# Altium project 48V-5V Buck.PrjPcb
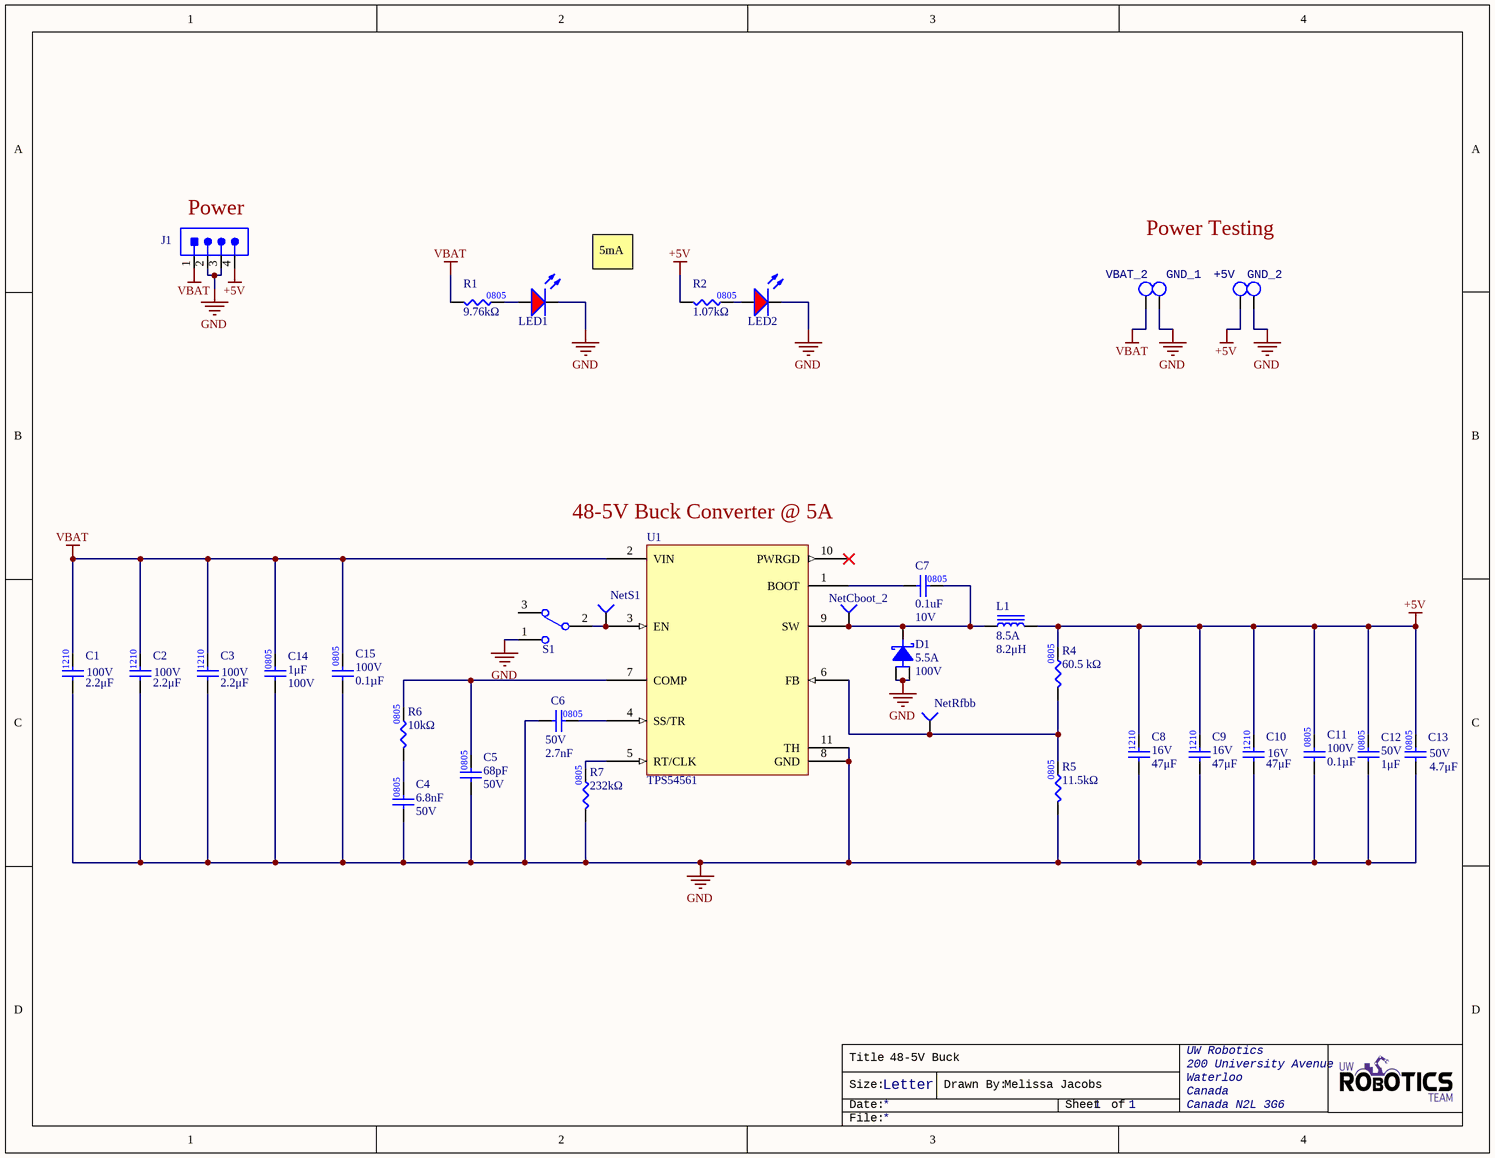
[diagram p0: 48V-5V Buck.SchDoc]
1 sheet, 35 parts. Net scope: global (net labels, ports and power ports of the same name join across sheets).
Board files: 48V-5V Buck.PcbDoc, 48V-5V Buck.~(1).PcbDoc

## Sheet 48V-5V Buck.SchDoc: 48-5V Buck
size Letter; DrawnBy: Melissa Jacobs; Organization: UW Robotics; Address1: 200 University Avenue; Address2: Waterloo; Address3: Canada; Address4: Canada N2L 3G6; Revision: 1; SheetNumber: 1; SheetTotal: 1

### Parts
+5V  TESTPOINT_LOOP  [TESTPOINT_LOOP]  (value not drawn)
C1  value 2.2μF  Voltage Rating: 100V  [CAPC3225X270N]  (hidden comment: CAP_2.2uF_100V_1210_1)
C2  value 2.2μF  Voltage Rating: 100V  [CAPC3225X270N]  (hidden comment: CAP_2.2uF_100V_1210_1)
C3  value 2.2μF  Voltage Rating: 100V  [CAPC3225X270N]  (hidden comment: CAP_2.2uF_100V_1210_1)
C4  value 6.8nF  Voltage Rating: 50V  [CAP0805]  (hidden comment: CAP_6.8nF_100V_0805)
C5  value 68pF  Voltage Rating: 50V  [CAP0805]  (hidden comment: CAP_68pF_50V_0805)
C6  value 2.7nF  Voltage Rating: 50V  [CAP0805]  (hidden comment: CAP_2.7nF_50V_0805)
C7  value 0.1uF  Voltage Rating: 10V  [CAP0805]  (hidden comment: CAP_0.1uF_10V_0805)
C8  value 47μF  Voltage Rating: 16V  [CAPC3225X270N]  (hidden comment: CAP_47uF_16V_1210)
C9  value 47μF  Voltage Rating: 16V  [CAPC3225X270N]  (hidden comment: CAP_47uF_16V_1210)
C10  value 47μF  Voltage Rating: 16V  [CAPC3225X270N]  (hidden comment: CAP_47uF_16V_1210)
C11  value 0.1µF  Voltage Rating: 100V  [CAP0805]  (hidden comment: CAP_0.1uF_100V_0805)
C12  value 1μF  Voltage Rating: 50V  [CAP0805]  (hidden comment: CAP_1uF_50V_0805)
C13  value 4.7μF  Voltage Rating: 50V  [CAP0805]  (hidden comment: CAP_4.7uF_50V_0805)
C14  value 1μF  Voltage Rating: 100V  [CAP0805]  (hidden comment: CAP_1uF_100V_0805)
C15  value 0.1µF  Voltage Rating: 100V  [CAP0805]  (hidden comment: CAP_0.1uF_100V_0805)
D1  5.5A  Vr (Max): 100V  [D-PAK]
GND_1  TESTPOINT_LOOP  [TESTPOINT_LOOP]  (value not drawn)
GND_2  TESTPOINT_LOOP  [TESTPOINT_LOOP]  (value not drawn)
J1  CON_2POS_SCREW_TERM  [MPT-04-01-01-L-RA-SD]  (value not drawn)
L1  value 8.2μH  Current Rating: 8.5A  [IND_8.2uH_8.5A]  (hidden comment: IND_8.2uH_8.5A)
LED1  LED_RED  [LED_0805_RED]  (value not drawn)
LED2  LED_RED  [LED_0805_RED]  (value not drawn)
NetCboot_2  TESTPOINT_1MM_CIRCLE  [TESTPOINT_CIRCLE_1MM]  (value not drawn)  (no BOM)
NetRfbb  TESTPOINT_1MM_CIRCLE  [TESTPOINT_CIRCLE_1MM]  (value not drawn)  (no BOM)
NetS1  TESTPOINT_1MM_CIRCLE  [TESTPOINT_CIRCLE_1MM]  (value not drawn)  (no BOM)
R1  value 9.76kΩ  [RES0805]  (hidden comment: RES_9.76kΩ_0805_1%)
R2  value 1.07kΩ  [RES0805]  (hidden comment: RES_1kΩ_0805_1%)
R4  value 60.5 kΩ  [RES0805]  (hidden comment: RES_60.4kΩ_0805_1%)
R5  value 11.5kΩ  [RES0805]  (hidden comment: RES_11.5kΩ_0805_0.1%)
R6  value 10kΩ  [RES0805]  (hidden comment: RES_10kΩ_0805_5%)
R7  value 232kΩ  [RES0805]  (hidden comment: RES_232kΩ_0805_1%)
S1  SW_SLIDE_TOGGLE  [SW_SLIDE_TOGGLE]  (value not drawn)
U1  TPS54561  [BUCK_TPS54561DPRR]
VBAT_2  TESTPOINT_LOOP  [TESTPOINT_LOOP]  (value not drawn)

### Nets
+5V: +5V.1 C8.2 C9.2 C10.2 C11.2 C12.2 C13.2 J1.4 L1.2 R2.1 R4.2
GND: C1.1 C2.1 C3.1 C4.1 C5.1 C6.1 C8.1 C9.1 C10.1 C11.1 C12.1 C13.1 C14.1 C15.1 D1.1(Anode) D1.3 GND_1.1 GND_2.1 J1.2 J1.3 LED1.2(K) LED2.2(K) R5.1 R7.1 S1.1 U1.8(GND) U1.11(TH)
VBAT: C1.2 C2.2 C3.2 C14.2 C15.2 J1.1 R1.1 U1.2(VIN) VBAT_2.1
NetC4_2: C4.2 R6.1
NetC5_2: C5.2 R6.2 U1.7(COMP)
NetC6_2: C6.2 U1.4(SS/TR)
NetC7_1: C7.1 U1.1(BOOT)
NetC7_2: C7.2 D1.2(Cathode) L1.1 NetCboot_2.1(=value) U1.9(SW)
NetLED1_1: LED1.1(A) R1.2
NetLED2_1: LED2.1(A) R2.2
NetNetRfbb_1: NetRfbb.1(=value) R4.1 R5.2 U1.6(FB)
NetNetS1_1: NetS1.1(=value) S1.2 U1.3(EN)
NetR7_2: R7.2 U1.5(RT/CLK)

Not connected (* = marked no-connect by the designer): S1 3; U1 10(PWRGD)*

### Notes on the sheet
- (near J1) Power
- Power Testing
- 5mA
- (near U1) 48-5V Buck Converter @ 5A
- Title
- Size:
- Date:
- Letter
- Drawn By:
- Sheet
- of
- File:

### Library data of the parts
+5V GND_1 GND_2 VBAT_2 = TESTPOINT_LOOP: TESTPOINT THRUHOLE; Manufacturer 1: Keystone Electronics; Manufacturer Part Number 1: 5002; Package/Footprint: TH; Supplier Part Number 1: 36-5002-ND; Supplier 1: Digi-Key; Mounting Type: TH
C1-C3 = CAP_2.2uF_100V_1210_1: CAP CER 2.2UF 100V X7R 1210; Manufacturer 1: TDK Corporation; Manufacturer Part Number 1: C3225X7R2A225K230AB; Package/Footprint: 1210; Supplier 1: Digi-Key; Supplier Part Number 1: 445-4497-1-ND; Mounting Type: SMD
C4 = CAP_6.8nF_100V_0805: CAP CER 6800PF 50V C0G/NP0 0805; Manufacturer 1: Murata Electronics; Manufacturer Part Number 1: GRM2195C1H682JA01D; Package/Footprint: 0805; Supplier 1: Digi-Key; Supplier Part Number 1: 490-1638-6-ND
C5 = CAP_68pF_50V_0805: CAP CER 68PF 50V C0G/NP0 0805; Manufacturer 1: Kyocera AVX; Manufacturer Part Number 1: KGM21BCG1H680JT; Package/Footprint: 0805; Supplier 1: Digi-Key; Supplier Part Number 1: 478-KGM21BCG1H680JTDKR-ND
C6 = CAP_2.7nF_50V_0805: CAP CER 2700PF 50V C0G 0805; Manufacturer 1: TDK Corporation; Manufacturer Part Number 1: C2012C0G1H272J060AA; Package/Footprint: 0805; Supplier 1: Digi-Key; Supplier Part Number 1: 445-7508-1-ND
C7 = CAP_0.1uF_10V_0805: CAP CER 0.1uF 10V 0805; Manufacturer 1: KEMET; Manufacturer Part Number 1: C0805C104K8RAC7800; Package/Footprint: 0805; Supplier 1: Digi-Key; Supplier Part Number 1: 399-C0805C104K8RAC7800DKR-ND
C8-C10 = CAP_47uF_16V_1210: CAP CER 47uF 16V X5R 1210; Manufacturer 1: Murata Electronics; Manufacturer Part Number 1: GRM32ER61C476KE15L; Package/Footprint: 1210; Supplier 1: Digi-Key; Supplier Part Number 1: 490-6539-6-ND; Mounting Type: SMD
C11 C15 = CAP_0.1uF_100V_0805: CAP CER 0.1UF 100V X7R 0805; Manufacturer 1: TDK Corporation; Manufacturer Part Number 1: C2012X7R2A104K125AA; Package: 0805; Supplier 1: Digi-Key; Supplier Part Number 1: 445-1418-1-ND
C12 = CAP_1uF_50V_0805: CAP CER 1UF 50V X7R 0805; Manufacturer Part Number 1: CL21B105KBFNNNG; Manufacturer 1: Samsung Electro-Mechanics; Supplier Part Number 1: 1276-6470-1-ND; Supplier 1: Digi-Key; Mounting Type: SMD; LCSC Part #: C28323; Package: 0805
C13 = CAP_4.7uF_50V_0805: CAP CER 4.7UF 50V X5R 0805; Manufacturer 1: TDK Corporation; Manufacturer Part Number 1: CGA4J3X5R1H475K125AB; Mounting Type: SMD; Supplier 1: Digi-Key; Supplier Part Number 1: 445-7882-1-ND; Package: 0805; LCSC Part #: C1779; Dielectric: X5R
C14 = CAP_1uF_100V_0805: CAP CER 1UF 100V X7S 0805; Supplier 1: Digi-Key; Mounting Type: SMD; Package: 0805; Supplier Part Number 1: 490-14464-1-ND
D1 = DIO_SCHOTTKY_100V_5.5A: DIODE SCHOTTKY 100V 5.5A DPAK; Manufacturer 1: Vishay General Semiconductor - Diodes Division; Manufacturer Part Number 1: VS-50WQ10FN-M3; Package/Footprint: TO-252-3, DPak (2 Leads + Tab), SC-63; Supplier 1: Digi-Key; Supplier Part Number 1: VS-50WQ10FN-M3-ND; Mounting Type: SMD
J1 = CON_4POS_POWERBLADE_MALE: CONN HDR 4POS 5MM R/A SLDR; Manufacturer 1: Samtec Inc.; Package/Footprint: PowerStrip™ 30 MTS; Supplier 1: Digi-Key; Mounting Type: TH; Supplier Part Number 1: SAM9727-ND; Manufacturer Part Number 1: MPT-04-01-01-L-RA-SD
L1 = IND_8.2uH_8.5A: FIXED IND 8.2UH 8.5A 28 MOHM SMD; Manufacturer 1: Vishay Dale; Manufacturer Part Number 1: IHLP5050CEER8R2M01; Supplier Part Number 1: 541-2596-6-ND; Supplier 1: Digi-Key; Mounting Type: SMD; Package/Footprint: SMD
LED1 LED2 = LED_RED: LED RED DIFFUSED 0805 SMD; Manufacturer 1: OSRAM; Manufacturer Part Number 1: LS R976-NR-1; Package/Footprint: 0805; Forward Voltage Drop: 2V; Supplier Part Number 1: 475-1278-1-ND; Supplier 1: Digi-Key; Mounting Type: SMD
NetCboot_2 NetRfbb NetS1 = TESTPOINT_1MM_CIRCLE: TESTPOINT 1MM CIRCLE
R1 = RES_9.76kΩ_0805_1%: RES 9.76K OHM 1% 1/8W 0805; Manufacturer 1: YAGEO; Manufacturer Part Number 1: RC0805FR-079K76L; Package/Footprint: 0805; Supplier Part Number 1: 311-9.76KCRCT-ND; Supplier 1: Digi-Key; Mounting Type: SMD
R2 = RES_1kΩ_0805_1%: RES 1K OHM 1% 1/8W 0805; Manufacturer 1: Yageo; Manufacturer Part Number 1: RC0805FR-071K07L; Supplier 1: Digi-Key; Mounting Type: SMD; Supplier Part Number 1: 311-1.07KCRCT-ND; Package: 0805
R4 = RES_60.4kΩ_0805_1%: RES 60.5 kOHM 63 mW 0805; Manufacturer 1: Vishay Dale; Manufacturer Part Number 1: RCS080560K4FKEA; Package/Footprint: 0805; Supplier Part Number 1: 541-RCS080560K4FKEADKR-ND; Supplier 1: Digi-Key; Mounting Type: SMD
R5 = RES_11.5kΩ_0805_0.1%: RES 11.5K OHM 0.1% 1/10W 0805; Manufacturer 1: TE Connectivity Passive Product; Manufacturer Part Number 1: RN73C2A11K5BTDF; Package/Footprint: 0805; Supplier Part Number 1: A103292DKR-ND; Supplier 1: Digi-Key; Mounting Type: SMD
R6 = RES_10kΩ_0805_5%: RES 10K OHM 5% 1/8W 0805; Manufacturer 1: Panasonic Electronic Components; Manufacturer Part Number 1: ERJ-6GEYJ103V; Package/Footprint: 0805; Supplier 1: Digi-Key; Supplier Part Number 1: P10KACT-ND; LCSC Part #: C17414; Mounting Type: SMD
R7 = RES_232kΩ_0805_1%: RES 232K OHM 1% 1/8W 0805; Manufacturer 1: Yageo; Manufacturer Part Number 1: RC0805FR-07232KL; Supplier 1: Digi-Key; Supplier Part Number 1: 311-232KCRDKR-ND; Mounting Type: SMD; LCSC Part #: 0; Package: 0805
S1 = SW_SLIDE_TOGGLE: SWITCH SLIDE SPDT 200MA 30V; Manufacturer 1: E-Switch; Manufacturer Part Number 1: 100SP1T1B4M2QE; Package/Footprint: TH; Supplier 1: Digi-Key; Mounting Type: TH; Voltage Rating (DC): 30V; Throw Configuration: SPDT; Supplier Part Number 1: EG1903-ND
U1 = TPS54561: Buck Switching Regulator IC Positive Adjustable 0.8V 1 Output 5A 10-WDFN Exposed Pad; Manufacturer 1: Texas Instruments; Manufacturer Part Number 1: TPS54561DPRR; Supplier 1: Digi-Key; Supplier Part Number 1: 296-40803-1-ND; Mounting Type: SMD; Package/Footprint: 10-WDFN Exposed Pad